# Altium project 16f877a Developer Board.PrjPcb (part 1 of 2)
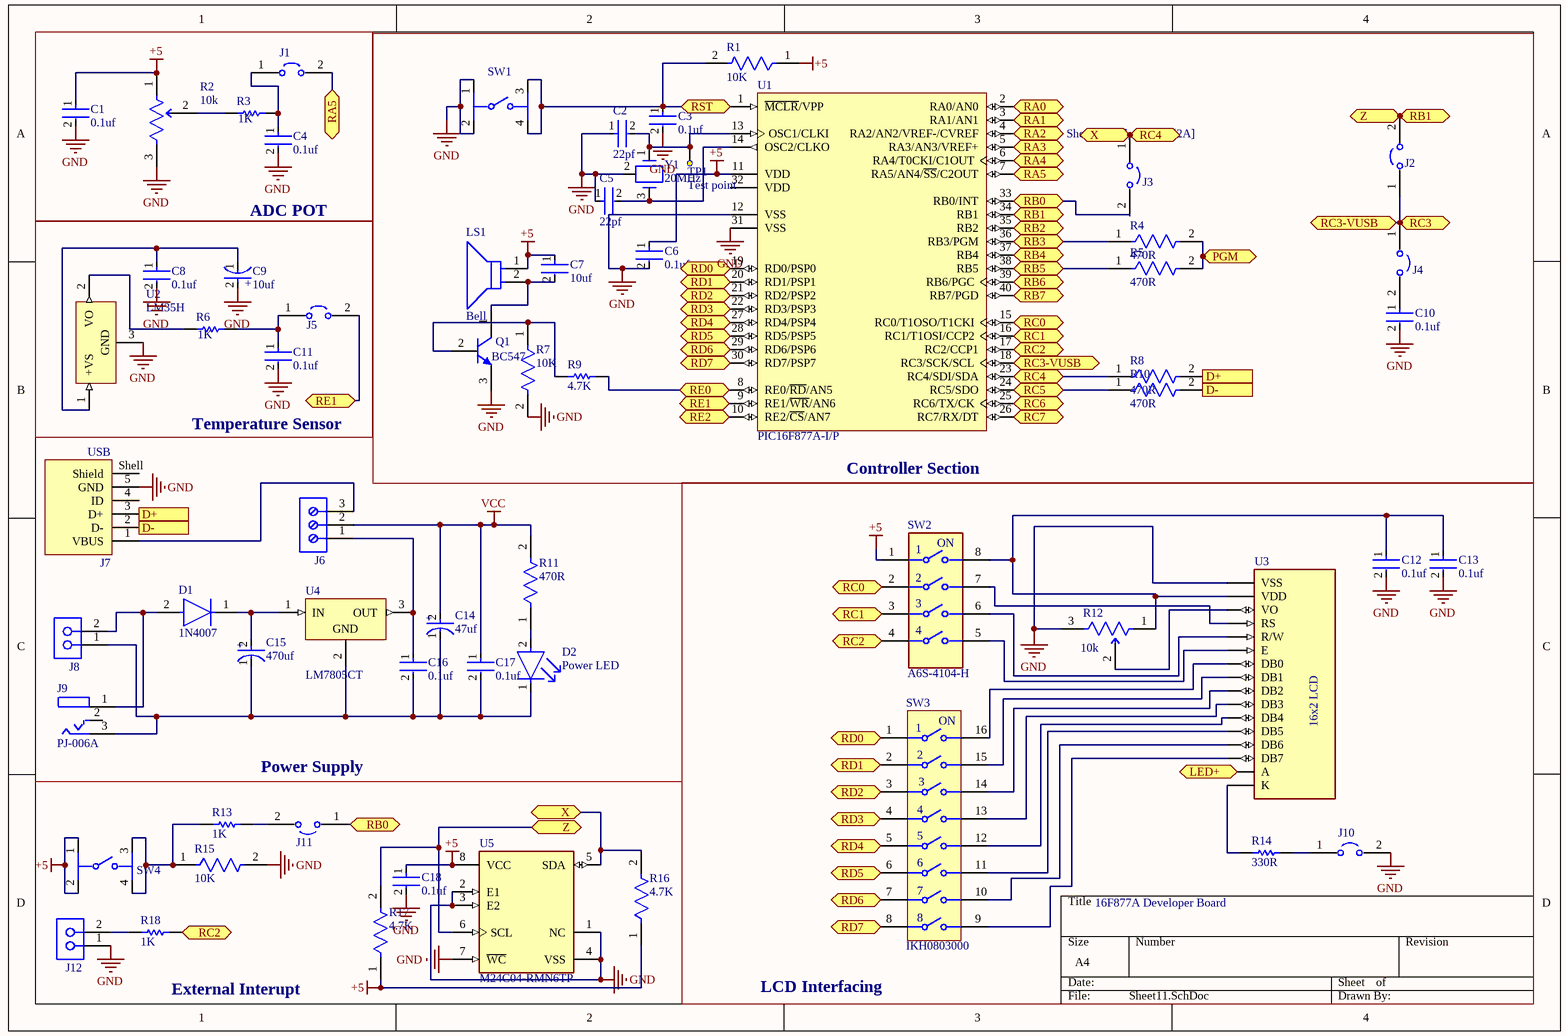
[diagram p0: Sheet11.SchDoc]
3 sheets, 167 parts. Net scope: flat (ports and power ports of the same name join across sheets).
Board file: PCB12.PcbDoc
Sheets:
  Sheet11.SchDoc
  Sheet12.SchDoc
  Sheet14.SchDoc

## Sheet Sheet11.SchDoc
size A4; SheetNumber: 1; SheetTotal: 3

### Parts
C1  0.1uf  [FP-C1206C-EB-MFG]
C2  22pf  [FP-RDE2M1-MFG]
C3  0.1uf  [FP-C1206C-EB-MFG]
C4  0.1uf  [FP-C1206C-EB-MFG]
C5  22pf  [FP-RDE2M1-MFG]
C6  0.1uf  [FP-C1206C-EB-MFG]
C7  10uf  [FP-B32522C0106K000-MFG]
C8  0.1uf  [FP-C1206C-EB-MFG]
C9  10uf  [FP-OS-CON-TH-E12-d_0_6-MFG]
C10  0.1uf  [FP-C1206C-EB-MFG]
C11  0.1uf  [FP-C1206C-EB-MFG]
C12  0.1uf  [FP-C1206C-EB-MFG]
C13  0.1uf  [FP-C1206C-EB-MFG]
C14  47uf  [FP-OS-CON-TH-F13-d_0_6-MFG]
C15  470uf  [FP-RAD-TH-D_12_5_0_5-L_30-MFG]
C16  0.1uf  [FP-C1206C-EB-MFG]
C17  0.1uf  [FP-C1206C-EB-MFG]
C18  0.1uf  [FP-C1206C-EB-MFG]
D1  1N4007  [FP-1N4007-MFG]
D2  Power LED  [FP-XLUR12D-MFG]
J1  S1911-46R  [FP-S1911-46R-MFG]  (value not drawn)
J2  S1911-46R  [FP-S1911-46R-MFG]  (value not drawn)
J3  S1911-46R  [FP-S1911-46R-MFG]  (value not drawn)
J4  S1911-46R  [FP-S1911-46R-MFG]  (value not drawn)
J5  S1911-46R  [FP-S1911-46R-MFG]  (value not drawn)
J6  691250910003  [691250910003]  (value not drawn)
J7  USB  [629105150521]
J8  691307300002  [691307300002]  (value not drawn)
J9  PJ-006A  [FP-PJ-006A-MFG]
J10  S1911-46R  [FP-S1911-46R-MFG]  (value not drawn)
J11  S1911-46R  [FP-S1911-46R-MFG]  (value not drawn)
J12  691307300002  [691307300002]  (value not drawn)
LS1  Bell  [FP-SD1614T5-A1-MFG]
Q1  BC547  [ONSC-TO-92-3-29-11]
R1  10K  [FP-CF18-MFG]
R2  10k  [FP-3310R-MFG]
R3  1K  [RESA60-630X240]
R4  470R  [FP-AC1210-MFG]
R5  470R  [FP-AC1210-MFG]
R6  1K  [RESA60-630X240]
R7  10K  [FP-CF18-MFG]
R8  470R  [FP-AC1210-MFG]
R9  4.7K  [RESC1812(4532)_N]
R10  470R  [FP-AC1210-MFG]
R11  470R  [FP-AC1210-MFG]
R12  10k  [FP-3310R-MFG]
R13  1K  [RESA60-630X240]
R14  330R  [RESC3226X70X40ML20T20]
R15  10K  [FP-CF18-MFG]
R16  4.7K  [FP-RCMM02-MFG]
R17  4.7K  [FP-RCMM02-MFG]
R18  1K  [RESA60-630X240]
SW1  TL3305AF260QG  [FP-TL3305AF260QG-MFG]  (value not drawn)
SW2  A6S-4104-H  [FP-A6S-4104-H-MFG]
SW3  IKH0803000  [IKH0803000_MFG]
SW4  TL3305AF260QG  [FP-TL3305AF260QG-MFG]  (value not drawn)
TP1  Test point  [REFERENCE POINT]
U1  PIC16F877A-I/P  [PDIP600-P40]
U2  LM35H  [NDV0003A]
U3  (no value)  [MODULE_LCD-16X2]
U4  LM7805CT  [FAIR-TO-220-3]
U5  M24C04-RMN6TP  [FP-SO8N-SO-A-MFG]
Y1  20MHz  [ECS-4X-3IL]

### Blocks framed on the sheet
ADC POT: C1 C4 J1 R2 R3
Controller Section: C2 C3 C5-C7 C10 J2-J4 LS1 Q1 R1 R4 R5 R7-R10 SW1 TP1 U1 Y1
Temperature Sensor: C8 C9 C11 J5 R6 U2

### Ports
D+ (in, see Sheet11[1B]), D+ (out, see Sheet11[4B]), D- (in, see Sheet11[1C]), D- (out, see Sheet11[4B]), LED+ (bidir), PGM (bidir, see Sheet12[3C], Sheet12[3D]), RA0 (bidir, see Sheet12[2B], Sheet14[2A]), RA1 (bidir, see Sheet12[2B], Sheet14[2A]), RA2 (bidir, see Sheet12[2B], Sheet14[2A]), RA3 (bidir, see Sheet12[2A], Sheet14[2A]), RA4 (bidir, see Sheet14[2A]), RA5 (bidir, see Sheet11[1A], Sheet14[3A]), RA5 (bidir, see Sheet11[3A], Sheet14[3A]), RB0 (bidir, see Sheet11[1D], Sheet12[1A], Sheet12[4D], Sheet14[3A]), RB0 (bidir, see Sheet11[3A], Sheet12[1A], Sheet12[4D], Sheet14[3A]), RB1 (bidir, see Sheet11[3A], Sheet12[2C], Sheet14[3A]), RB1 (bidir, see Sheet11[4A], Sheet12[2C], Sheet14[3A]), RB2 (bidir, see Sheet12[2C], Sheet14[2C], Sheet14[3A]), RB3 (bidir, see Sheet12[2D], Sheet14[2C], Sheet14[3A]), RB4 (bidir, see Sheet12[2D], Sheet14[3B]), RB5 (bidir, see Sheet12[2C], Sheet14[3B]), RB6 (bidir, see Sheet12[2C], Sheet12[3C], Sheet12[3D], Sheet14[3A]), RB7 (bidir, see Sheet12[2C], Sheet12[3C], Sheet12[3D], Sheet14[3A]), RC0 (bidir, see Sheet11[3B], Sheet14[2A], Sheet14[2C]), RC0 (bidir, see Sheet11[3C], Sheet14[2A], Sheet14[2C]), RC1 (bidir, see Sheet11[3B], Sheet14[2A], Sheet14[2C]), RC1 (bidir, see Sheet11[3C], Sheet14[2A], Sheet14[2C]), RC2 (bidir, see Sheet11[1D], Sheet11[3B], Sheet14[2A], Sheet14[2C]), RC2 (bidir, see Sheet11[1D], Sheet11[3C], Sheet14[2A], Sheet14[2C]), RC2 (bidir, see Sheet11[3B], Sheet11[3C], Sheet14[2A], Sheet14[2C]), RC3 (bidir, see Sheet14[2A], Sheet14[2D]), RC3-VUSB (bidir, see Sheet11[3B]), RC3-VUSB (bidir, see Sheet11[4A]), RC4 (bidir, see Sheet11[3A], Sheet14[2B]), RC4 (bidir, see Sheet11[3B], Sheet14[2B]), RC5 (bidir, see Sheet14[3B]), RC6 (bidir, see Sheet14[1A], Sheet14[3A]), RC7 (bidir, see Sheet14[1A], Sheet14[3A]), RD0 (bidir, see Sheet11[2B], Sheet12[2A], Sheet14[3A]), RD0 (bidir, see Sheet11[3C], Sheet12[2A], Sheet14[3A]), RD1 (bidir, see Sheet11[2B], Sheet12[2A], Sheet14[3A]), RD1 (bidir, see Sheet11[3C], Sheet12[2A], Sheet14[3A]), RD2 (bidir, see Sheet11[2B], Sheet12[2A], Sheet14[3A]), RD2 (bidir, see Sheet11[3D], Sheet12[2A], Sheet14[3A]), RD3 (bidir, see Sheet11[2B], Sheet12[2A], Sheet14[3A]), RD3 (bidir, see Sheet11[3D], Sheet12[2A], Sheet14[3A]), RD4 (bidir, see Sheet11[2B], Sheet12[2A], Sheet14[3A]), RD4 (bidir, see Sheet11[3D], Sheet12[2A], Sheet14[3A]), RD5 (bidir, see Sheet11[2B], Sheet12[2A], Sheet14[3A]), RD5 (bidir, see Sheet11[3D], Sheet12[2A], Sheet14[3A]), RD6 (bidir, see Sheet11[2B], Sheet12[2A], Sheet14[3A]), RD6 (bidir, see Sheet11[3D], Sheet12[2A], Sheet14[3A]), RD7 (bidir, see Sheet11[2B], Sheet12[2A], Sheet14[3A]), RD7 (bidir, see Sheet11[3D], Sheet12[2A], Sheet14[3A]), RE0 (bidir, see Sheet14[3A]), RE1 (bidir, see Sheet11[1B], Sheet14[3A]), RE1 (bidir, see Sheet11[2B], Sheet14[3A]), RE2 (bidir, see Sheet14[3A]), RST (bidir, see Sheet12[3C], Sheet12[3D]), X (bidir, see Sheet11[2D], Sheet12[1B]), X (bidir, see Sheet11[3A], Sheet12[1B]), Z (bidir, see Sheet11[2D], Sheet12[1B]), Z (bidir, see Sheet11[4A], Sheet12[1B])

### Nets
+5: C1.1 C6.1 C7.1 C18.1 LS1.1(C) R1.1 R2.1(CCW) R16.1 R17.1 SW2.1 SW4.1 SW4.2 U1.11(VDD) U5.8(VCC)
GND: C1.2 C2.1 C3.2 C4.2 C5.1 C6.2 C8.2 C9.2(A) C10.2 C11.2 C12.2 C13.2 C18.2 J7.5(GND) J10.2 J12.1 Q1.3(E) R2.3(CW) R7.2 R12.3(CW) R15.2 SW1.1 SW1.2 U1.12(VSS) U1.31(VSS) U2.3(GND) U3.1(VSS) U5.1(NC) U5.2(E1) U5.3(E2) U5.4(VSS) U5.7(~{WC}) Y1.2
VCC: C14.2(A) C17.1 J6.2 R11.2
NetC2_2: C2.2 TP1.1 U1.13(OSC1/CLKI) Y1.1
NetC3_1: C3.1 R1.2 SW1.3 SW1.4 U1.1(~{MCLR}/VPP) ; port RST
NetC4_1: C4.1 J1.1 R3.2
NetC5_2: C5.2 U1.14(OSC2/CLKO) Y1.3
NetC7_2: C7.2 LS1.2(A) Q1.1(C)
NetC8_1: C8.1 C9.1(C) U2.1(+VS)
NetC10_1: C10.1 J4.2
NetC11_1: C11.1 J5.1 R6.2
NetC12_1: C12.1 C13.1 R12.1(CCW) SW2.8 U3.2(VDD)
NetC14_1: C14.1(C) C15.1(C) C16.2 C17.2 D2.1(C) J8.1 J9.3 U4.2(GND)
NetC15_2: C15.2(A) D1.1(C) U4.1(IN)
NetC16_1: C16.1 J6.1 U4.3(OUT)
NetD1_2: D1.2(A) J8.2 J9.1
NetD2_2: D2.2(A) R11.1
NetJ1_2: J1.2 U1.7(RA5/AN4/~{SS}/C2OUT) ; port RA5
NetJ2_1: J2.1 J4.1 U1.18(RC3/SCK/SCL) ; port RC3-VUSB, port RC3
NetJ2_2: J2.2 R17.2 U1.34(RB1) U5.6(SCL) ; port RB1, port Z
NetJ3_1: J3.1 R8.1 R16.2 U1.23(RC4/SDI/SDA) U5.5(SDA) ; port RC4, port X
NetJ3_2: J3.2 J11.1 U1.33(RB0/INT) ; port RB0
NetJ5_2: J5.2 U1.9(RE1/~{WR}/AN6) ; port RE1
NetJ6_3: J6.3 J7.1(VBUS)
NetJ7_2: J7.2(D-) R10.2 ; port D-
NetJ7_3: J7.3(D+) R8.2 ; port D+
NetJ10_1: J10.1 R14.2
NetJ11_2: J11.2 R13.1
NetJ12_2: J12.2 R18.2
NetJ14_4: U1.40(RB7/PGD) ; port RB7
NetJ14_5: U1.39(RB6/PGC) ; port RB6
NetJ14_6: R4.2 R5.2 ; port PGM
NetJ15_1: U1.35(RB2) ; port RB2
NetJ16_1: R4.1 U1.36(RB3/PGM) ; port RB3
NetP2_1: U1.19(RD0/PSP0) ; port RD0
NetP2_3: SW3.2 U1.20(RD1/PSP1) ; port RD1
NetP2_5: U1.21(RD2/PSP2) ; port RD2
NetP2_6: U1.30(RD7/PSP7) ; port RD7
NetP2_7: SW3.4 U1.22(RD3/PSP3) ; port RD3
NetP2_8: U1.29(RD6/PSP6) ; port RD6
NetP2_9: U1.27(RD4/PSP4) ; port RD4
NetP2_10: SW3.6 U1.28(RD5/PSP5) ; port RD5
NetP3_1: U1.2(RA0/AN0) ; port RA0
NetP3_3: U1.3(RA1/AN1) ; port RA1
NetP3_4: U1.10(RE2/~{CS}/AN7) ; port RE2
NetP3_5: U1.4(RA2/AN2/VREF-/CVREF) ; port RA2
NetP3_7: U1.5(RA3/AN3/VREF+) ; port RA3
NetP3_8: R9.2 U1.8(RE0/~{RD}/AN5) ; port RE0
NetP3_9: U1.6(RA4/T0CKI/C1OUT) ; port RA4
NetP5_9: U1.37(RB4) ; port RB4
NetP5_10: R5.1 U1.38(RB5) ; port RB5
NetP6_1: SW2.2 U1.15(RC0/T1OSO/T1CKI) ; port RC0
NetP6_3: SW2.3 U1.16(RC1/T1OSI/CCP2) ; port RC1
NetP6_5: R18.1 SW2.4 U1.17(RC2/CCP1) ; port RC2
NetP6_6: U1.26(RC7/RX/DT) ; port RC7
NetP6_8: U1.25(RC6/TX/CK) ; port RC6
NetP6_10: R10.1 U1.24(RC5/SDO) ; port RC5
NetQ1_2: Q1.2(B) R7.1 R9.1
NetR2_2: R2.2 R3.1
NetR6_1: R6.1 U2.2(VO)
NetR12_2: R12.2 U3.3(VO)
NetR13_2: R13.2 R15.1 SW4.3 SW4.4
NetR14_1: R14.1 U3.16(K)
NetSW2_5: SW2.5 U3.6(E)
NetSW2_6: SW2.6 U3.5(R/W)
NetSW2_7: SW2.7 U3.4(RS)
NetSW3_9: SW3.9 U3.14(DB7)
NetSW3_10: SW3.10 U3.13(DB6)
NetSW3_11: SW3.11 U3.12(DB5)
NetSW3_12: SW3.12 U3.11(DB4)
NetSW3_13: SW3.13 U3.10(DB3)
NetSW3_14: SW3.14 U3.9(DB2)
NetSW3_15: SW3.15 U3.8(DB1)
NetSW3_16: SW3.16 U3.7(DB0)

Not connected (* = marked no-connect by the designer): J7 4(ID) Shell(Shield); J9 2; SW3 1 3 5 7 8; U1 32(VDD); U3 15(A)

### Notes on the sheet
- Power Supply
- (near R14) 16F877A Developer Board
- External Interupt
- LCD Interfacing
- (in symbol CMP-00638-06323270-1) ON
- (in symbol CMP-05427-000129-1) +
- (in symbol CMP-05428-000118-1) +
- (in symbol CMP-05428-000334-1) +
- (in symbol CMP-08827-000006-1) ON
- (in symbol LCD-16X2) 16x2 LCD

### Library data of the parts
C1 C3 C4 C6 C8 C10-C13 C16-C18 = CMP-03020-018297-1: C1206 0.10 μF U2J 20.00% 50 V; Manufacturer: KEMET; Manufacturer Part Number: C1206C104M5JACAUTO; Voltage Rating: 50 V; Automotive Grade: Grade 0; Capacitance: 0.10 μF; Value: 0.10 μF; Temperature Coefficient: 15%; Tolerance: 0.2; Material: Ceramic; Height: 0.88mm; Lead Free: Yes; ComponentLink2Description: Datasheet; ComponentLink2URL: https://content.kemet.com/datasheets/KEM_C1007_X8R_ULTRA_150C_SMD.pdf; Ipc Land Pattern Name: CAPC320160X78; Temperature Characteristic: U2J; RoHS: TRUE; Octopart: https://octopart.com/c1206c104m5jacauto-kemet-84732526; Package: C1206C-EB; Temperature Range Low: -55°C; Automotive: Yes; Temperature Range High: +150°C; Category: Cap; Device Class L3: Ceramic Capacitors; Device Class L2: Capacitors; Temperature: -55°C to +150°C; Device Class L1: Passive Components
C2 C5 = CMP-06035-034601-1: Ceramic Capacitor 22pF ±5% 1kV C0G Radial
C7 = CMP-00131-20738498-1: B32522C0106K000 Cap Film 10uF 63V PET 10% (18 X 9 X 17.5mm) Radial Stacked 15mm 125C Automotive Bulk; Dielectric Material: Polyester; Lead Diameter: 800µm; Capacitance: 10µF; Termination: Radial; Tolerance: 10%; Max Operating Temperature: 125°C; Depth: 9mm; Max Length: 18mm; Dielectric: PET; Height: 17.5mm; Min Operating Temperature: -55°C; Lifecycle Status: Production; Case/Package: Radial; Voltage Rating: 63V; RoHS: Compliant; Max Width: 9mm; Voltage Rating (DC): 63V; Packaging: Bulk; Length: 18mm; REACH SVHC: Unknown; Contact Plating: Tin; Mount: Through Hole; Lead Pitch: 15mm; Voltage Rating (AC): 63V; Schedule B: 8532250010, 8532250010; NexarPartId: 20738498
C9 = CMP-05428-000118-1: Conductive Polymer Aluminum Solid Capacitors (OS-CON) 18uF ±20% 100V RADIAL TH 8x12mm; ESR (Equivalent Series Resistance): 40mR; Capacitance: 18uF; Max Operating Temperature: 125°C; Voltage Rating: 100V; Case/Package: Radial; Mount: Through Hole; Min Operating Temperature: -55°C; Series: OS-CON™, SXE; Tolerance: 20%
C14 = CMP-05428-000334-1: Conductive Polymer Aluminum Solid Capacitors (OS-CON) 47uF ±20% 80V RADIAL TH 10x13mm; Life (Hours): 1000Hour; ESR (Equivalent Series Resistance): 28mR; Max Operating Temperature: 125°C; Case/Package: Radial; RoHS Compliant: Yes; Tolerance: 20%; Packaging: Bulk; Min Operating Temperature: -55°C; Series: OS-CON™, SXE; Mount: Through Hole; Voltage Rating: 80V; Capacitance: 47uF
C15 = CMP-05427-000129-1: Aluminum Electrolytic Capacitors (Radial Lead Type) 470uF ±20% 80V; RoHS Compliant: Yes
D1 = CMP-123542-000001-1: Rectifier diode 1000 V 1 A DO-41, ,; Manufacturer: Diotec; Max Surge Forward Current: 27A; Forward Current: 1A; Max Junction Temp: +175°C; Reverse Voltage: 1000V; Value: 15pF; Peak Reverse Current: 5uA; Category: Diode; Temperature Range Low: -50°C; Automotive: No; Temperature: -50°C to +175°C; Lead Free: Yes; ComponentLink2Description: Datasheet; Max Repetitive Reverse Voltage: 1000V; ComponentLink2URL: https://datasheet.octopart.com/1N4007-Diotec-datasheet-62346875.pdf; Manufacturer Part Number: 1N4007; Device Class L3: Rectifier Diodes; Height: 2.8mm; Octopart: https://octopart.com/1n4007-diotec-4040411; Package: 1N4007; Temperature Range High: +175°C; Device Class L1: Discrete Semiconductors; Device Class L2: Diodes; RoHS: TRUE; Capacitance: 15pF; Ipc Land Pattern Name: DIOAD888W100L520D280
D2 = CMP-02085-08376351-1: 627nm Red LED; 5x8.6mm, Through-Hole Mount with Red Diffused Round Lamp; Test Current: 10mA; Viewing Angle: 30°; Dominant Wavelength: 617nm; Luminous Intensity: 39mcd; Forward Voltage: 1.9V; Wavelength: 627nm; Case/Package: Radial; Lens Color: Red; Mount: Through Hole; Height: 8.6mm; Color: Red; Lifecycle Status: Production; Lens Transparency: Diffused; RoHS: Compliant
J1-J5 J10 J11 = CMP-15817-000009-1: JUMPER TIN SMD; Gender: Non-Gendered; Current Rating: 10A; Number of Contacts: 2; Pitch: 0.119inch; Material: Brass; REACH SVHC: No SVHC; Number of Rows: 1; Plating: Tin; Contact Plating: Tin; Length: 6.85mm; RoHS Compliant: Yes; Height: 0.038inch; Packaging: Tape and Reel; Contact Material: Brass; Orientation: Straight; Termination: SMD/SMT; Depth: 2.51mm; Color: Silver; Number of Positions: 2; Series: S1; Package Quantity: 4000
J6 = CMP-1502-02751-3: Terminal Block, 9.52MM Pitch, Horizontal, Rising Cage Clamp, 10-30 AWG, 3 Pin; Current Rating: 24A; Voltage Rating: 300V; Number of Contacts: 3; Height: 21.6mm; Min Operating Temperature: -30°C; Max Operating Temperature: 120°C; Number of Rows: 1; RoHS: Compliant
J7 = CMP-1502-03252-4: USB Connector, 5 Contact(s), Female, Right Angle, Surface Mount Terminal, Locking; Operating Supply Voltage: 30V; USB Standard: USB 2.0; Insulation Resistance: 1GΩ; Contact Resistance: 30mΩ; Current Rating: 3A; Gender: Receptacle; Number of Contacts: 5; Height: 2.86mm; Connector Type: USB; Min Operating Temperature: -40°C; Max Operating Temperature: 85°C; Number of Pins: 5; Contact Material: Gold; Features: Shielded; Voltage Rating: 30V; RoHS: Compliant; Termination: SMD/SMT; Orientation: Horizontal; REACH SVHC: Unknown; Contact Plating: Gold; Mount: Horizontal, Surface Mount; Packaging: Tape and Reel; Lead Free: Lead Free
J8 J12 = CMP-1502-01831-3: Terminal Block, Socket, 2Pos, Th Rohs Compliant: Yes; Number of Positions Per Level: 2; Number of Levels: 1; Voltage: 300V; Current: 8A; Pitch: 3.81mm; Gender: Female; Lead Pitch: 3.81mm; RoHS: Compliant; Contact Plating: Tin; Mount: Through Hole; Number of Positions: 2; Packaging: Box; Min Operating Temperature: -40°C; Max Operating Temperature: 115°C; Number of Pins: 2; Termination: Solder; Orientation: Vertical; Color: Green
J9 = CMP-14830-000002-1: CONN PWR JACK 2X5.5MM SOLDER; Manufacturer: CUI Inc; Voltage Rating: 24V; Conn Orientation: Vertical; Conn Gender: Male; Current Rating: 5A; Number Of Contacts: 1; RoHS: TRUE; Package: PJ-006A; Contact Material: Nickel,Copper; Temperature: -25°C to +70°C; Octopart: https://octopart.com/pj-006a-cui-286899; Temperature Range High: +70°C; Mouser Description: 2.0 mm Center Pin, 5.0 A, Vertical, Through Hole, Dc Power Jack Connector; Automotive: No; Height: 13.5mm; Device Class L2: Power Connectors; Lead Free: Yes; Device Class L1: Connectors; Temperature Range Low: -25°C; Manufacturer Part Number: PJ-006A; ComponentLink2URL: https://upverter.com/datasheet/9ed293f1fa29a0cd2acf14ef7c71896f95dae00a.pdf; Category: Conn; Device Class L3: unset; Digikey Description: CONN PWR JACK 2X5.5MM SOLDER; ComponentLink2Description: Datasheet
LS1 = CMP-08413-000005-1: BUZZER MAGNETIC 5V 80DB 2048HZ 1; Frequency: 2.048kHz; Operating Supply Current: 80mA; Max Operating Temperature: 85°C; Min Operating Temperature: -40°C; Voltage Rating: 5V; Termination: PC Pins; Sensing Method: Magnetic; Mount: Panel
Q1 = CMP-1048-01464-1: Amplifier Transistor, NPN Silicon, 3-Pin TO-92, Pb-Free, Bulk Box; Manufacturer: On Semiconductor; PartNumber: BC547CG; IC Continuous (A): 0.1; fT Min (MHz): 150; ComponentLink3URL: http://www.onsemi.cn/pub_link/Collateral/2N6426-D.PDF; Mounting Technology: Through Hole; PackageReference: TO-92-3-29-11_AM_SL; ComponentLink2Description: Datasheet; RoHS: TRUE; Packing: Bulk Box; ComponentLink1Description: Manufacturer URL; PackageDescription: 3-Pin Transistor Outline, Body 4.825 x 3.685 mm, Pitch 1.27 mm; PackageVersion: Rev. AM; ComponentLink2URL: http://www.onsemi.com/pub_link/Collateral/BC546-D.PDF; ComponentLink3Description: Package Specification; ComponentLink1URL: http://www.onsemi.com/; DatasheetVersion: Rev. 7; Polarity: NPN
R1 R7 R15 = CMP-26528-000002-1: RES 10K OHM 1/8W 5% CF AXIAL; Manufacturer Part Number: CF18JT10K0; Manufacturer: Stackpole Electronics; Power Rating: 0.125W; Temperature Coefficient: 0-500ppm/°C; Resistance: 10kΩ; Voltage Rating: 250V; Value: 10kΩ; Temperature: -55°C to +155°C; Height: 2mm; Lead Free: Yes; Automotive: No; Device Class L2: Resistors; Package: CF18; Series: CF; ComponentLink2Description: Datasheet; Ipc Land Pattern Name: RESAD656W65L360D200; Temperature Range High: +155°C; RoHS: TRUE; Device Class L3: Through-Hole Resistors; Temperature Range Low: -55°C; Device Class L1: Passive Components; Category: Res; Octopart: https://octopart.com/cf18jt10k0-stackpole+electronics-19205642; Composition: Carbon Film; Digikey Description: RES 10K OHM 1/8W 5% CF AXIAL; ComponentLink2URL: http://www.seielect.com/Catalog/SEI-CF_CFM.pdf; Tolerance: 5%
R2 R12 = CMP-07234-000023-1: POT 10K OHM 1/4W PLASTIC LINEAR; Resistance: 10kR; Max Power Dissipation: 250mW; Temperature Coefficient: 1000ppm/°C; Actuator Length: 0.22inch; Tolerance: 20%; Actuator Diameter: 0.125inch; Number of Turns: 1; Type: Potentiometer; Taper: Linear; Max Operating Temperature: 125°C; Package Quantity: 50; Packaging: Bulk; Composition: Conductive Plastic; REACH SVHC: No SVHC; Contact Plating: Tin; Number of Gangs: 1; Weight: 4.5g; Mount: Through Hole; Min Operating Temperature: -40°C; Termination: Pin; Power Rating: 250mW
R3 R6 R13 R18 = CMP-1659-00075-1: Axial Resistor, 1 KOhm, +/- 1%, 250 mW, -55 to 155 degC, 2-Pin THD, RoHS, Bulk; Voltage Rating: 250 V; Resistance: 10 kohm; Power Rating: 250 mW; ComponentLink2Description: Datasheet; RoHSCompliant: true; PackageReference: MFR-25; Case\Package: Axial; Max Operating Temperature: 155 degC; DatasheetVersion: Apr-13; Tolerance: 1%; ComponentLink1URL: http://www.yageo.com/; Length: 0.248 inch; ComponentLink2URL: http://www.yageo.com/documents/recent/Yageo%20LR_MFR_2013.pdf; Packaging: Bulk; Package Quantity: 200; PackageDescription: 2-Pin Axial Lead, Dia 2.4 mm, Body Length 6.3 mm; Min Operating Temperature: -55 degC; ComponentLink1Description: Manufacturer URL
R4 R5 R8 R10 R11 = CMP-03412-021586-1: RES SMD 470 OHM 5% 1/2W 1210; Manufacturer Part Number: AC1210JR-07470RL; Manufacturer: Yageo; Tolerance: 0.05; Resistance: 470Ω; Voltage Rating: 200V; Power Rating: 0.5W; Value: 470Ω; Automotive Grade: Grade 0; Lead Free: Yes; RoHS: TRUE; Series: AC; Digikey Description: RES SMD 470 OHM 5% 1/2W 1210; Package: AC1210; Temperature Range High: +155°C; Composition: Thick Film; Temperature: -55°C to +155°C; Temperature Range Low: -55°C; Device Class L3: Chip SMD Resistors; Height: 0.65mm; ComponentLink2URL: http://www.yageo.com/NewPortal/yageodocoutput?fileName=/pdf/R-Chip/PYu-AC_51_RoHS_L_6.pdf; Octopart: https://octopart.com/ac1210jr-07470rl-yageo-71368950; Device Class L1: Passive Components; Category: Res; Footprint Url: http://www.yageo.com/exep/pages/download/literatures/PYu-R_Mount_9.pdf; Automotive: Yes; ComponentLink2Description: Datasheet; Device Class L2: Resistors; Ipc Land Pattern Name: RESC310260X55
R9 = CMP-1016-00090-1: 4K7 0.75W 5% 1812 (4532 Metric)  SMD; Case-Metric: 4532; Case-EIA: 1812; Value: 4700.00 Ohm; Tolerance: 5 %; Power: 0.75 W; Technology: SMT
R14 = CMP-2005-02232-1: Manufacturer: KOA Speer; Part Number: RK73B2ETTE331J
R16 R17 = CMP-02408-000034-1: RES 4.7K OHM 2% 1/2W AXIAL; Temperature Coefficient: 100ppm/°C; Resistance: 4.7kR; RoHS Compliant: Yes; Contact Plating: Tin; Tolerance: 2%; Diameter: 2.5mm; Case/Package: Molded; Length: 6.5mm; Mount: Through Hole; Resistor Type: Metal Film
SW1 SW4 = CMP-17879-000010-1: SWITCH TACTILE SPST-NO 50MA 12V; Mechanical Life: 200000Cycles; Switch Function: Off-Mom; Actuator Type: Standard; Operating Force: 260gf; Illumination Type: Non-Illuminated; Switch Travel: 0.2mm; Throw Configuration: SPST; Min Operating Temperature: -20°C; Max Operating Temperature: 70°C; Lead Free: Lead Free; Mount: Surface Mount; Packaging: Tape and Reel; Termination: Gull Wing
SW2 = CMP-08827-000006-1: SWITCH SLIDE DIP SPST 25MA 24V; Manufacturer: Omron Electronics Inc-EMC Div; Number Of Circuits: 4; Electromechanical Life: 1000Cycles; Contact Resistance: 200mΩ; Standoff Height: 0.7mm; Device Class L3: DIP Switches; Throw Configuration: SPST; Mouser Description: DIP Switches / SIP Switches Dip Switch; Device Class L2: Switches; Ambient Temperature Range Low: -20°C; Temperature: -20°C to +70°C; Digikey Description: SWITCH SLIDE DIP SPST 25MA 24V; Temperature Range Low: -20°C; Octopart: https://octopart.com/a6s-4104-h-omron-1480027; Package: 0; Device Class L1: Electromechanical; ComponentLink2URL: https://omronfs.omron.com/en_US/ecb/products/pdf/en-a6s.pdf; Temperature Range High: +70°C; Mount: Surface Mount; Voltage Rating Dc: 24V; Automotive: No; RoHS: TRUE; Manufacturer Part Number: A6S-4104-H; Category: Switch; ComponentLink2Description: Datasheet; Lead Free: Yes; Height: 4.5mm; Ambient Temperature Range High: +70°C; Contact Current Rating: 25mA
SW3 = CMP-00638-06323270-1: Switch DIP ON OFF SPST 8 Recessed Slide 0.025A 24VDC Gull Wing 1.27mm SMD Tube; Number of Positions: 8; Voltage Rating (DC): 50V; Electrical Life: 1kcycles; Insulation Resistance: 100MΩ; Washable: Yes; Current Rating: 25mA; Max Operating Temperature: 70°C; ComponentLink2URL: https://www.apem.com/media/apemProduct/IKH_Series_Dual_in_Line_2018.pdf; ComponentLink2Description: Datasheet URL; ComponentLink1URL: http://www.apem.com/; Terminal Pitch: 1.27mm; Mount: Surface Mount; RoHS: Compliant; Contact Material: Bronze; Throw Configuration: SPST; Min Operating Temperature: -20°C; Number of Pins: 8; Termination: Solder; HelpURL: https://www.apem.com/media/apemProduct/IKH_Series_Dual_in_Line_2018.pdf; ComponentLink1Description: Manufacturer's Website
U1 = CMP-0115-00183-1: Enhanced FLASH Microcontroller, 8K (x14-Bit words) FLASH, 368 Bytes RAM, 40-Pin PDIP, Standard VDD Range, Industrial Temperature; ComponentAvailability: Unknown. Contact manufacturer to determine status.; PackageReference: PDIP600-P40; PackageVersion: revBB, Aug-2009; PackageDescription: 40-Lead Plastic Dual In-Line (P) - 600 mil Body [PDIP]; DatasheetVersion: revB, Oct-2003
U2 = CMP-0066-00004-3: Precision Centigrade Temperature Sensor, 3-pin TO-46; Manufacturer: Texas Instruments; PackageTopMarking: NSXYTTE# LM35H; PowerWise: N; CompType: Temp Sensor IC; ComponentLink1Description: Datasheet URL; ComponentLink1URL: http://www.ti.com/general/docs/lit/getliterature.tsp?genericPartNumber=LM35&fileType=pdf; PackageReference: NDV0003A; PinCount: 3; Code_JEDEC: TO-46; RoHS: N; PackageDescription: Metal Can, TO-46, 3 Lead, .100in Dia, P.C.
U3 = LCD-16X2: Display Development Tools 16x2 Black on Green Char LCD w Backlight; MF: Gravitech; SnapEDA_Link: https://www.snapeda.com/parts/LCD-16X2/Gravitech/view-part/?ref=snap; Package: None; Value: *; MP: LCD-16X2; Check_prices: https://www.snapeda.com/parts/LCD-16X2/Gravitech/view-part/?ref=eda
U4 = CMP-2000-04938-1: Positive Voltage Regulator, 5 V, 1 A, -40 to 125 degC, 3-Pin TO-220, RoHS, Tube; Manufacturer: FairchildSemiconductor; Maximum Input Voltage: 35V; Maximum Quiescent Current: 8mA; Load Regulation: 100mV; Maximum Output Current: 2.2(Typ)A; Output Type: Fixed; Typical Dropout Voltage @ Current: 2@1AV; Rad Hard: No; Output Voltage: 5V; Accuracy: ±4%; Number of Outputs: 1; Category: LinearRegulator; Package Description: 3-Pin Through Hole Device, Body 10 x 4.5 mm, Pitch 2.54 mm; Packaging: Rail/Tube; Mounting: ThroughHole; Polarity: Positive; Manufacturer URL: https://www.fairchildsemi.com/; Line Regulation: 100mV; Datasheet Version: Aug-12; Datasheet URL: https://datasheet.ciiva.com/26904/lm7805ct-26904988.pdf; Package Reference: TO-220; Package URL: https://www.fairchildsemi.com/package-drawings/TO/TO220B03.pdf; Package: 3TO-220AB; Operating Temperature: -40to125degC; Type: Linear
U5 = CMP-12142-000003-1: IC EEPROM 4K I2C 400KHZ 8SO; Manufacturer: STMicroelectronics; Min Supply Voltage: 1.8V; Nominal Supply Current: 0.5-0.8mA; Memory Size: 4Kbits; Max Supply Voltage: 5.5V; Standoff Height: 0.1mm; Manufacturer Part Number: M24C04-RMN6TP; Frequency: 400kHz; Package: SO8N-SO-A; Device Class L2: Memory; Digikey Description: IC EEPROM 4K I2C 400KHZ 8SO; ComponentLink2Description: Datasheet; Memory Type: EEPROM; Automotive: No; Device Class L1: Integrated Circuits (ICs); Lead Free: Yes; ComponentLink2URL: https://www.st.com/resource/en/datasheet/m24c04-r.pdf; Temperature Range High: +85°C; Mouser Description: M24C04-R Series 4 Kb I2C 2 Wire (512 K x 8) 1.8 V Serial EEPROM SMT - SOIC-8; Height: 1.75mm; Temperature Range Low: -40°C; Device Class L3: EEPROM; Octopart: https://octopart.com/m24c04-rmn6tp-stmicroelectronics-7870337; Category: IC; Temperature: -40°C to +85°C; Ambient Temperature Range High: +85°C; Interface: I2C; Ambient Temperature Range Low: -40°C; RoHS: TRUE
Y1 = CMP-1669-00001-2: CRYSTAL 20.000MHZ 20PF 49US; Manufacturer: ECS; PartNumber: ECS-200-20-4X; ComponentLink1URL: http://www.ecsxtal.com/store/pdf/hc-49usx.pdf; ComponentLink1Description: Datasheet; PackageReference: 4X-3IL

## Sheet Sheet12.SchDoc
size A4; SheetNumber: 2; SheetTotal: 3
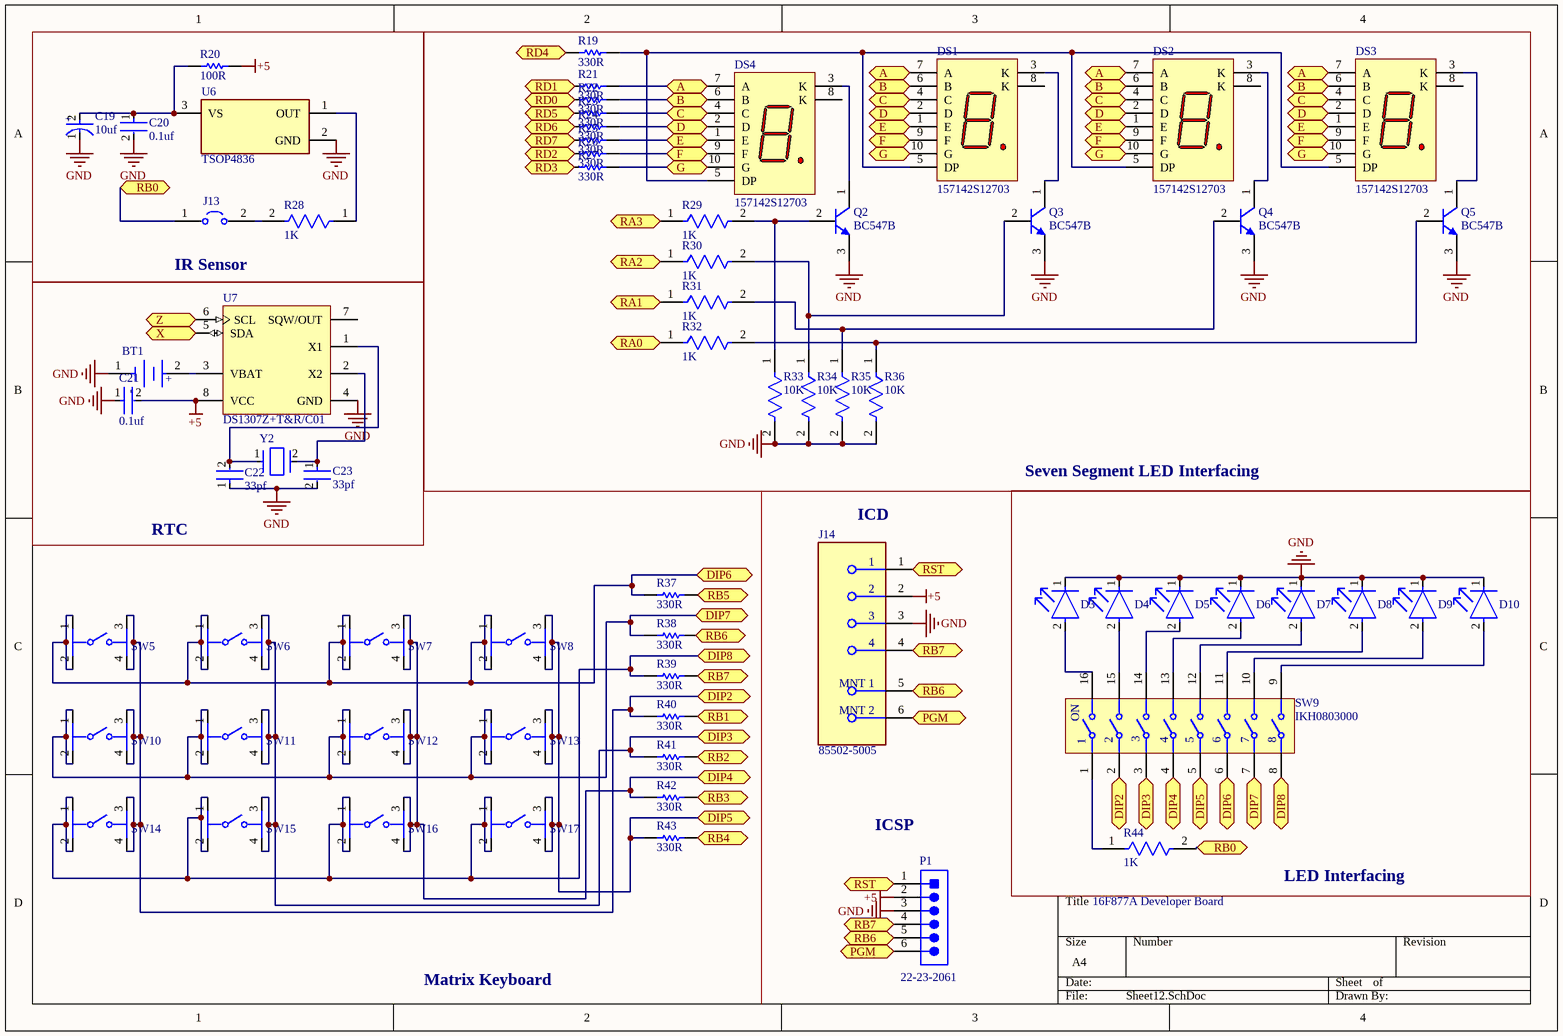
[diagram p1: Sheet12.SchDoc]

### Parts
BT1  3034  [FP-3034-MFG]  (value not drawn)
C19  10uf  [FP-OS-CON-TH-E12-d_0_6-MFG]
C20  0.1uf  [FP-C1206C-EB-MFG]
C21  0.1uf  [FP-C1206C-EB-MFG]
C22  33pf  [FP-RDE1K1-MFG]
C23  33pf  [FP-RDE1K1-MFG]
D3  XLUR12D  [FP-XLUR12D-MFG]  (value not drawn)
D4  XLUR12D  [FP-XLUR12D-MFG]  (value not drawn)
D5  XLUR12D  [FP-XLUR12D-MFG]  (value not drawn)
D6  XLUR12D  [FP-XLUR12D-MFG]  (value not drawn)
D7  XLUR12D  [FP-XLUR12D-MFG]  (value not drawn)
D8  XLUR12D  [FP-XLUR12D-MFG]  (value not drawn)
D9  XLUR12D  [FP-XLUR12D-MFG]  (value not drawn)
D10  XLUR12D  [FP-XLUR12D-MFG]  (value not drawn)
DS1  157142S12703  [WL-T7DS_L19W12.6H7.9]
DS2  157142S12703  [WL-T7DS_L19W12.6H7.9]
DS3  157142S12703  [WL-T7DS_L19W12.6H7.9]
DS4  157142S12703  [WL-T7DS_L19W12.6H7.9]
J13  S1911-46R  [FP-S1911-46R-MFG]  (value not drawn)
J14  85502-5005  [FP-85502-5005-MFG]
P1  22-23-2061  [MOLX-22-23-2061_V]
Q2  BC547B  [ONSC-TO-92-3-29-11]
Q3  BC547B  [ONSC-TO-92-3-29-11]
Q4  BC547B  [ONSC-TO-92-3-29-11]
Q5  BC547B  [ONSC-TO-92-3-29-11]
R19  330R  [RESC3226X70X40ML20T20]
R20  100R  [RESC3116X65X40NL10T20]
R21  330R  [RESC3226X70X40ML20T20]
R22  330R  [RESC3226X70X40ML20T20]
R23  330R  [RESC3226X70X40ML20T20]
R24  330R  [RESC3226X70X40ML20T20]
R25  330R  [RESC3226X70X40ML20T20]
R26  330R  [RESC3226X70X40ML20T20]
R27  330R  [RESC3226X70X40ML20T20]
R28  1K  [FP-RQ732B-IPC_C]
R29  1K  [FP-RQ732B-IPC_C]
R30  1K  [FP-RQ732B-IPC_C]
R31  1K  [FP-RQ732B-IPC_C]
R32  1K  [FP-RQ732B-IPC_C]
R33  10K  [FP-CF18-MFG]
R34  10K  [FP-CF18-MFG]
R35  10K  [FP-CF18-MFG]
R36  10K  [FP-CF18-MFG]
R37  330R  [RESC3226X70X40ML20T20]
R38  330R  [RESC3226X70X40ML20T20]
R39  330R  [RESC3226X70X40ML20T20]
R40  330R  [RESC3226X70X40ML20T20]
R41  330R  [RESC3226X70X40ML20T20]
R42  330R  [RESC3226X70X40ML20T20]
R43  330R  [RESC3226X70X40ML20T20]
R44  1K  [FP-RQ732B-IPC_C]
SW5  TL3305AF260QG  [FP-TL3305AF260QG-MFG]  (value not drawn)
SW6  TL3305AF260QG  [FP-TL3305AF260QG-MFG]  (value not drawn)
SW7  TL3305AF260QG  [FP-TL3305AF260QG-MFG]  (value not drawn)
SW8  TL3305AF260QG  [FP-TL3305AF260QG-MFG]  (value not drawn)
SW9  IKH0803000  [IKH0803000_MFG]
SW10  TL3305AF260QG  [FP-TL3305AF260QG-MFG]  (value not drawn)
SW11  TL3305AF260QG  [FP-TL3305AF260QG-MFG]  (value not drawn)
SW12  TL3305AF260QG  [FP-TL3305AF260QG-MFG]  (value not drawn)
SW13  TL3305AF260QG  [FP-TL3305AF260QG-MFG]  (value not drawn)
SW14  TL3305AF260QG  [FP-TL3305AF260QG-MFG]  (value not drawn)
SW15  TL3305AF260QG  [FP-TL3305AF260QG-MFG]  (value not drawn)
SW16  TL3305AF260QG  [FP-TL3305AF260QG-MFG]  (value not drawn)
SW17  TL3305AF260QG  [FP-TL3305AF260QG-MFG]  (value not drawn)
U6  TSOP4836  [FP-6_550-5169_01-4-MFG]
U7  DS1307Z+T&R/C01  [S8+2_N]
Y2  ECS-80-20-4X  [FP-ECS-80-20-4X-MFG]  (value not drawn)

### Blocks framed on the sheet
IR Sensor: C19 C20 J13 R20 R28 U6
Seven Segment LED Interfacing: DS1-DS4 Q2-Q5 R19 R21-R27 R29-R36
RTC: BT1 C21-C23 U7 Y2

### Ports
A (bidir, see Sheet12[2A], Sheet12[3A]), A (bidir, see Sheet12[2A], Sheet12[3A], Sheet12[4A]), A (bidir, see Sheet12[3A], Sheet12[4A]), B (bidir, see Sheet12[2A], Sheet12[3A]), B (bidir, see Sheet12[2A], Sheet12[3A], Sheet12[4A]), B (bidir, see Sheet12[3A], Sheet12[4A]), C (bidir, see Sheet12[2A], Sheet12[3A]), C (bidir, see Sheet12[2A], Sheet12[3A], Sheet12[4A]), C (bidir, see Sheet12[3A], Sheet12[4A]), D (bidir, see Sheet12[2A], Sheet12[3A]), D (bidir, see Sheet12[2A], Sheet12[3A], Sheet12[4A]), D (bidir, see Sheet12[3A], Sheet12[4A]), DIP2 (bidir, see Sheet12[2C]), DIP2 (bidir, see Sheet12[3D]), DIP3 (bidir, see Sheet12[2C]), DIP3 (bidir, see Sheet12[3D]), DIP4 (bidir, see Sheet12[2D]), DIP4 (bidir, see Sheet12[4D]), DIP5 (bidir, see Sheet12[2D]), DIP5 (bidir, see Sheet12[4D]), DIP6 (bidir, see Sheet12[2C]), DIP6 (bidir, see Sheet12[4D]), DIP7 (bidir, see Sheet12[2C]), DIP7 (bidir, see Sheet12[4D]), DIP8 (bidir, see Sheet12[2C]), DIP8 (bidir, see Sheet12[4D]), E (bidir, see Sheet12[2A], Sheet12[3A]), E (bidir, see Sheet12[2A], Sheet12[3A], Sheet12[4A]), E (bidir, see Sheet12[3A], Sheet12[4A]), F (bidir, see Sheet12[2A], Sheet12[3A]), F (bidir, see Sheet12[2A], Sheet12[3A], Sheet12[4A]), F (bidir, see Sheet12[3A], Sheet12[4A]), G (bidir, see Sheet12[2A], Sheet12[3A]), G (bidir, see Sheet12[2A], Sheet12[3A], Sheet12[4A]), G (bidir, see Sheet12[3A], Sheet12[4A]), PGM (bidir, see Sheet11[4A], Sheet12[3C]), PGM (bidir, see Sheet11[4A], Sheet12[3D]), RA0 (bidir, see Sheet11[3A], Sheet14[2A]), RA1 (bidir, see Sheet11[3A], Sheet14[2A]), RA2 (bidir, see Sheet11[3A], Sheet14[2A]), RA3 (bidir, see Sheet11[3A], Sheet14[2A]), RB0 (bidir, see Sheet11[1D], Sheet11[3A], Sheet12[1A], Sheet14[3A]), RB0 (bidir, see Sheet11[1D], Sheet11[3A], Sheet12[4D], Sheet14[3A]), RB1 (bidir, see Sheet11[3A], Sheet11[4A], Sheet14[3A]), RB2 (bidir, see Sheet11[3A], Sheet14[2C], Sheet14[3A]), RB3 (bidir, see Sheet11[3A], Sheet14[2C], Sheet14[3A]), RB4 (bidir, see Sheet11[3A], Sheet14[3B]), RB5 (bidir, see Sheet11[3B], Sheet14[3B]), RB6 (bidir, see Sheet11[3B], Sheet12[2C], Sheet12[3C], Sheet14[3A]), RB6 (bidir, see Sheet11[3B], Sheet12[2C], Sheet12[3D], Sheet14[3A]), RB6 (bidir, see Sheet11[3B], Sheet12[3C], Sheet12[3D], Sheet14[3A]), RB7 (bidir, see Sheet11[3B], Sheet12[2C], Sheet12[3C], Sheet14[3A]), RB7 (bidir, see Sheet11[3B], Sheet12[2C], Sheet12[3D], Sheet14[3A]), RB7 (bidir, see Sheet11[3B], Sheet12[3C], Sheet12[3D], Sheet14[3A]), RD0 (bidir, see Sheet11[2B], Sheet11[3C], Sheet14[3A]), RD1 (bidir, see Sheet11[2B], Sheet11[3C], Sheet14[3A]), RD2 (bidir, see Sheet11[2B], Sheet11[3D], Sheet14[3A]), RD3 (bidir, see Sheet11[2B], Sheet11[3D], Sheet14[3A]), RD4 (bidir, see Sheet11[2B], Sheet11[3D], Sheet14[3A]), RD5 (bidir, see Sheet11[2B], Sheet11[3D], Sheet14[3A]), RD6 (bidir, see Sheet11[2B], Sheet11[3D], Sheet14[3A]), RD7 (bidir, see Sheet11[2B], Sheet11[3D], Sheet14[3A]), RST (bidir, see Sheet11[2A], Sheet12[3C]), RST (bidir, see Sheet11[2A], Sheet12[3D]), X (bidir, see Sheet11[2D], Sheet11[3A]), Z (bidir, see Sheet11[2D], Sheet11[4A])

### Nets
+5: C21.2 J14.2 P1.2 R20.1 U7.8(VCC)
GND: BT1.1(C) C19.1(C) C20.2 C21.1 C22.1 C23.2 D3.1(C) D4.1(C) D5.1(C) D6.1(C) D7.1(C) D8.1(C) D9.1(C) D10.1(C) J14.3 P1.3 Q2.3(E) Q3.3(E) Q4.3(E) Q5.3(E) R33.2 R34.2 R35.2 R36.2 U6.2(GND) U7.4(GND)
NetBT1_2: BT1.2(A) U7.3(VBAT)
NetC3_1: J14.1 P1.1 ; port RST
NetC19_2: C19.2(A) C20.1 R20.2 U6.3(VS)
NetC22_2: C22.2 U7.1(X1) Y2.1
NetC23_1: C23.1 U7.2(X2) Y2.2
NetD3_2: D3.2(A) SW9.16
NetD4_2: D4.2(A) SW9.15
NetD5_2: D5.2(A) SW9.14
NetD6_2: D6.2(A) SW9.13
NetD7_2: D7.2(A) SW9.12
NetD8_2: D8.2(A) SW9.11
NetD9_2: D9.2(A) SW9.10
NetD10_2: D10.2(A) SW9.9
NetDS1_1: DS1.1(E) DS2.1(E) DS3.1(E) DS4.1(E) R25.2 ; port E
NetDS1_2: DS1.2(D) DS2.2(D) DS3.2(D) DS4.2(D) R24.2 ; port D
NetDS1_3: DS1.3(K) Q3.1(C)
NetDS1_4: DS1.4(C) DS2.4(C) DS3.4(C) DS4.4(C) R23.2 ; port C
NetDS1_5: DS1.5(DP) DS2.5(DP) DS3.5(DP) DS4.5(DP) R19.2
NetDS1_6: DS1.6(B) DS2.6(B) DS3.6(B) DS4.6(B) R22.2 ; port B
NetDS1_7: DS1.7(A) DS2.7(A) DS3.7(A) DS4.7(A) R21.2 ; port A
NetDS1_9: DS1.9(F) DS2.9(F) DS3.9(F) DS4.9(F) R26.2 ; port F
NetDS1_10: DS1.10(G) DS2.10(G) DS3.10(G) DS4.10(G) R27.2 ; port G
NetDS2_3: DS2.3(K) Q4.1(C)
NetDS3_3: DS3.3(K) Q5.1(C)
NetDS4_3: DS4.3(K) Q2.1(C)
NetJ2_2: R40.2 U7.6(SCL) ; port Z, port RB1
NetJ3_1: U7.5(SDA) ; port X
NetJ3_2: J13.1 R44.2 ; port RB0
NetJ13_2: J13.2 R28.2
NetJ14_4: J14.4 P1.4 R39.2 ; port RB7
NetJ14_5: J14.5(MNT_1) P1.5 ; port RB6
NetJ14_6: J14.6(MNT_2) P1.6 ; port PGM
NetJ15_1: R41.2 ; port RB2
NetJ16_1: R42.2 ; port RB3
NetP2_9: R19.1 ; port RD4
NetP3_1: R32.1 ; port RA0
NetP3_3: R31.1 ; port RA1
NetP3_5: R30.1 ; port RA2
NetP3_7: R29.1 ; port RA3
NetP5_9: R43.2 ; port RB4
NetP5_10: R37.2 ; port RB5
NetQ2_2: Q2.2(B) R29.2 R33.1
NetQ3_2: Q3.2(B) R30.2 R34.1
NetQ4_2: Q4.2(B) R31.2 R35.1
NetQ5_2: Q5.2(B) R32.2 R36.1
NetR28_1: R28.1 U6.1(OUT)
NetR37_1: R37.1 SW5.1 SW5.2 SW6.1 SW6.2 SW7.1 SW7.2 SW8.1 SW8.2 ; port DIP6
NetR38_1: R38.1 SW10.1 SW10.2 SW11.1 SW11.2 SW12.1 SW12.2 SW13.1 SW13.2 ; port DIP7
NetR39_1: R39.1 SW14.1 SW14.2 SW15.1 SW15.2 SW16.1 SW16.2 SW17.1 SW17.2 ; port DIP8
NetR40_1: R40.1 SW5.3 SW5.4 SW10.3 SW10.4 SW14.3 SW14.4 ; port DIP2
NetR41_1: R41.1 SW6.3 SW6.4 SW11.3 SW11.4 SW15.3 SW15.4 ; port DIP3
NetR42_1: R42.1 SW7.3 SW7.4 SW12.3 SW12.4 SW16.3 SW16.4 ; port DIP4
NetR43_1: R43.1 SW8.3 SW8.4 SW13.3 SW13.4 SW17.3 SW17.4 ; port DIP5
NetR44_1: R44.1 SW9.1

Not connected (* = marked no-connect by the designer): DS1 8(K); DS2 8(K); DS3 8(K); DS4 8(K); R21 1; R22 1; R23 1; R24 1; R25 1; R26 1; R27 1; R38 2; SW9 2 3 4 5 6 7 8; U7 7(SQW/OUT)

### Notes on the sheet
- (near J14) ICD
- (near P1) ICSP
- (near R44) 16F877A Developer Board
- LED Interfacing
- Matrix Keyboard
- (in symbol CMP-00638-06323270-1) ON
- (in symbol CMP-05428-000118-1) +
- (in symbol CMP-19636-000006-1) +; -

### Library data of the parts
BT1 = CMP-19636-000006-1: BATTERY RETAINER COIN 20MM SMD; Manufacturer: Keystone Electronics; Number Of Contacts: 2; Height: 4.31mm; Device Class L1: Connectors; Device Class L3: unset; RoHS: TRUE; Automotive: No; Mouser Description: Coin Cell Battery Holders COIN CELL RETAINER; Contact Material: Nickel; Digikey Description: BATTERY RETAINER COIN 20MM SMD; Category: Batt; Package: 3034; ComponentLink2URL: https://www.keyelco.com/product-pdf.cfm?p=798; Manufacturer Part Number: 3034; Octopart: https://octopart.com/3034-keystone-27554462; ComponentLink2Description: Datasheet; Device Class L2: unset; Lead Free: Yes
C19 = CMP-05428-000118-1: as C9 on sheet Sheet11; Capacitance: 18uF; Max Operating Temperature: 125°C; Voltage Rating: 100V; Case/Package: Radial; Mount: Through Hole; Min Operating Temperature: -55°C; Series: OS-CON™, SXE; Tolerance: 20%
C20 C21 = CMP-03020-018297-1: as C1 on sheet Sheet11; Height: 0.88mm; Lead Free: Yes; ComponentLink2Description: Datasheet; ComponentLink2URL: https://content.kemet.com/datasheets/KEM_C1007_X8R_ULTRA_150C_SMD.pdf; Ipc Land Pattern Name: CAPC320160X78; Temperature Characteristic: U2J; RoHS: TRUE; Octopart: https://octopart.com/c1206c104m5jacauto-kemet-84732526; Package: C1206C-EB; Temperature Range Low: -55°C; Automotive: Yes; Temperature Range High: +150°C; Category: Cap; Device Class L3: Ceramic Capacitors; Device Class L2: Capacitors; Temperature: -55°C to +150°C; Device Class L1: Passive Components
C22 C23 = CMP-06035-044214-1: Ceramic Capacitor 33pF ±5% 630V C0G Radial
D3-D10 = CMP-02085-08376351-1: as D2 on sheet Sheet11; Wavelength: 627nm; Case/Package: Radial; Lens Color: Red; Mount: Through Hole; Height: 8.6mm; Color: Red; Lifecycle Status: Production; Lens Transparency: Diffused; RoHS: Compliant
DS1-DS4 = CMP-03913-119894002-2: 7-Seg Display, Comm Cathode, Super Red Rohs Compliant: Yes; Forward Voltage: 2V; Dominant Wavelength: 635nm; Forward Current: 100mA; Max Reverse Voltage (DC): 5V; Luminous Intensity: 20mcd; Min Operating Temperature: -40°C; RoHS: Compliant; Length: 19mm; Width: 12.6mm; Max Operating Temperature: 85°C; Height: 8mm
J13 = CMP-15817-000009-1: as J1 on sheet Sheet11; Material: Brass; REACH SVHC: No SVHC; Number of Rows: 1; Plating: Tin; Contact Plating: Tin; Length: 6.85mm; RoHS Compliant: Yes; Height: 0.038inch; Packaging: Tape and Reel; Contact Material: Brass; Orientation: Straight; Termination: SMD/SMT; Depth: 2.51mm; Color: Silver; Number of Positions: 2; Series: S1; Package Quantity: 4000
J14 = CMP-04778-000028-1: CONN MOD JACK 4P4C R/A UNSHLD; Pitch: 1.27mm; Number of Positions: 4; Insulation Resistance: 500MR; Gender: Female; Shielding: Unshielded; Number of Ports: 1; Connector Type: Socket; Max Voltage Rating (AC): 125V; Number of Circuits: 2; Current Rating: 1.5A; Contact Resistance: 20mR; Halogen Free: Low Halogen; Width: 11.5mm; Flammability Rating: UL94 V-0; Radiation Hardening: No; Packaging: Tape and Reel; Min Operating Temperature: -40°C; Package Quantity: 1470; RoHS Compliant: Yes; Color: Black; Number of Positions Loaded: 4; Contact Plating: Gold; Depth: 18.1mm; Mount: Surface Mount; Orientation: Right Angle; Contact Material: Brass; Termination: SMD/SMT; Housing Material: Polymer; Length: 14.13mm; Series: 85502; Voltage Rating (AC): 125V; Housing Color: Black; Max Operating Temperature: 80°C; Number of Contacts: 4
P1 = CMP-2000-05536-1: Male Header, Pitch 2.54 mm, 1 x 6 Position, Height 10.67 mm, Tail Length 3.56 mm, 0 to 70 degC, RoHS, Bulk; Manufacturer: Molex; Pitch: 2.54mm; Mounting Angle: Vertical; Current Rating: 4A; Number of Positions / Contacts: 6; Voltage Rating: 250V; Packaging: Bulk; Package Description: Male Header, Pitch 2.54 mm, 1 x 6 Position, Height 10.67 mm, Tail Length 3.56 mm; Number of Rows: 1; Type: PinStrip; Contact Material: Brass; Product Category: .100K.K.Connectors; Factory Pack Quantity: 1000; Mounting Style: ThroughHole; RoHS: Details; Contact Plating: Tin; Housing Material: Nylon; Mounting Technology: ThroughHole; Termination Style: ThroughHole; Tradename: KK; Number of Positions: 6; Brand: Molex; Product Type: Headers; Series: 6373; Datasheet URL: https://datasheet.ciiva.com/19460/232303-19460895.pdf; Package Reference: 22-23-2061; Datasheet Version: Rev. P, 09/2001; Manufacturer URL: http://www.molex.com/
Q2-Q5 = CMP-1048-01467-1: Amplifier Transistor, NPN Silicon, 3-Pin TO-92, Bulk Box; Manufacturer: On Semiconductor; IC Continuous (A): 0.1; fT Min (MHz): 150; DatasheetVersion: Rev. 7; ComponentLink1URL: http://www.onsemi.com/; Polarity: NPN; RoHS: FALSE; ComponentLink1Description: Manufacturer URL; Packing: Bulk Box; PackageDescription: 3-Pin Transistor Outline, Body 4.825 x 3.685 mm, Pitch 1.27 mm; ComponentLink3URL: http://www.onsemi.cn/pub_link/Collateral/2N6426-D.PDF; ComponentLink2Description: Datasheet; PackageVersion: Rev. AM; PackageReference: TO-92-3-29-11_AM_SL; ComponentLink3Description: Package Specification; Mounting Technology: Through Hole; PartNumber: BC547B; ComponentLink2URL: http://www.onsemi.com/pub_link/Collateral/BC546-D.PDF
R19 R21-R27 R37-R43 = CMP-2005-02232-1: as R14 on sheet Sheet11
R20 = CMP-2003-04959-1: Manufacturer: Yageo; Part Number: RC1206FR-10100RL
R28-R32 R44 = CMP-03211-006012-1: RQ732B 1206 1KΩ 0.4W 10ppm/°C 0.1% 200V; Manufacturer: TE; Manufacturer Part Number: RQ73C2B1K0BTDF; Automotive Grade: Grade 0; ComponentLink2URL: https://www.te.com/commerce/DocumentDelivery/DDEController?Action=showdoc&DocId=Data+Sheet%7F1773270-2%7FA%7Fpdf%7FEnglish%7FENG_DS_1773270-2_A.pdf%7F9-2176388-1149; Device Class L2: Resistors; Tolerance: 0.1%; Temperature Coefficient: 10ppm/°C; Resistance: 1KΩ; Value: 1KΩ; Temperature Range High: +155°C; Temperature Range Low: -55°C; Package: RQ732B; Composition: Thin Film; Lead Free: Yes; Power Rating: 0.4W; Voltage Rating: 200V; RoHS: TRUE; Device Class L1: Passive Components; Device Class L3: Chip SMD Resistors; Octopart: https://octopart.com/rq73c2b1k0btdf-te+connectivity-99292457; Category: Res; Automotive: Yes; Ipc Land Pattern Name: RESC310160X60; Height: 0.75mm; Temperature: -55°C to +155°C; ComponentLink2Description: Datasheet; Series: RQ73
R33-R36 = CMP-26528-000002-1: as R1 on sheet Sheet11; Temperature: -55°C to +155°C; Height: 2mm; Lead Free: Yes; Automotive: No; Device Class L2: Resistors; Package: CF18; Series: CF; ComponentLink2Description: Datasheet; Ipc Land Pattern Name: RESAD656W65L360D200; Temperature Range High: +155°C; RoHS: TRUE; Device Class L3: Through-Hole Resistors; Temperature Range Low: -55°C; Device Class L1: Passive Components; Category: Res; Octopart: https://octopart.com/cf18jt10k0-stackpole+electronics-19205642; Composition: Carbon Film; Digikey Description: RES 10K OHM 1/8W 5% CF AXIAL; ComponentLink2URL: http://www.seielect.com/Catalog/SEI-CF_CFM.pdf; Tolerance: 5%
SW5-SW8 SW10-SW17 = CMP-17879-000010-1: as SW1 on sheet Sheet11; Min Operating Temperature: -20°C; Max Operating Temperature: 70°C; Lead Free: Lead Free; Mount: Surface Mount; Packaging: Tape and Reel; Termination: Gull Wing
SW9 = CMP-00638-06323270-1: as SW3 on sheet Sheet11; Max Operating Temperature: 70°C; ComponentLink2URL: https://www.apem.com/media/apemProduct/IKH_Series_Dual_in_Line_2018.pdf; ComponentLink2Description: Datasheet URL; ComponentLink1URL: http://www.apem.com/; Terminal Pitch: 1.27mm; Mount: Surface Mount; RoHS: Compliant; Contact Material: Bronze; Throw Configuration: SPST; Min Operating Temperature: -20°C; Number of Pins: 8; Termination: Solder; HelpURL: https://www.apem.com/media/apemProduct/IKH_Series_Dual_in_Line_2018.pdf; ComponentLink1Description: Manufacturer's Website
U6 = CMP-00030-55401809-1: TSOP4836 TSOP48 Series 5.5 V 36 kHz Through Hole IR Receiver Modules for Remote Control; Min Supply Voltage (DC): 2.5V; Max Supply Voltage (DC): 5.5V; Lead Length: 23.6mm; Power Dissipation: 10mW; Nominal Supply Current: 950µA; Wavelength: 950nm; Sensing Distance: 45m; Operating Supply Current: 700µA; Viewing Angle: 45°; Frequency: 36kHz; Output Current: 5mA; Min Supply Voltage: 2.7V; Height: 6.95mm; RoHS: Compliant; Mount: Through Hole; NexarPartId: 55401809; Case/Package: TSOP; Max Supply Voltage: 5.5V; Width: 5.6mm; REACH SVHC: Unknown; Lead Free: Lead Free; Schedule B: 8541409500; Min Operating Temperature: -25°C; Radiation Hardening: No; Max Operating Temperature: 85°C; Length: 6mm; Contact Plating: Tin; Number of Pins: 3; Orientation: Side View
U7 = CMP-0254-00302-1: 64 x 8, Serial, I2C Real-Time Clock, 5.0V, 8-Pin SO, 0 to 70 degC, Pb-Free, Reel; ComponentLink1URL: http://www.maxim-ic.com; PackageReference: S8+2; ComponentLink3URL: http://pdfserv.maxim-ic.com/package_dwgs/21-0041.PDF; Code_JEDEC: MS-012-AA; PackageDescription: 8-Pin Small-Outline IC, Narrow (0.15in), 1.27 mm Pitch, SOIC (N), Pb-Free; PackageVersion: revC, 2010; ComponentLink3Description: Package Specification; Code_IPC: SOIC127P600-8; ComponentLink1Description: Manufacturer URL; DatasheetVersion: 10-Feb-2008; ComponentLink2Description: Datasheet; ComponentLink2URL: http://datasheets.maxim-ic.com/en/ds/DS1307.pdf
Y2 = CMP-1669-00002-3: NexarPartId: 316504; Frequency Stability: 50ppm; ESR (Equivalent Series Resistance): 80Ω; Frequency: 8MHz; Tolerance: 0.003%; Load Capacitance: 20pF; Schedule B: 8541600025, 8541600025; Number of Pins: 49; Max Operating Temperature: 70°C; Lead Free: Lead Free; Height: 3.5mm; Termination: Radial; RoHS: Compliant; Frequency Tolerance: 0.003%; Packaging: Bulk; Mount: Through Hole; Width: 4.65mm; Length: 11.3538mm; Min Operating Temperature: -10°C